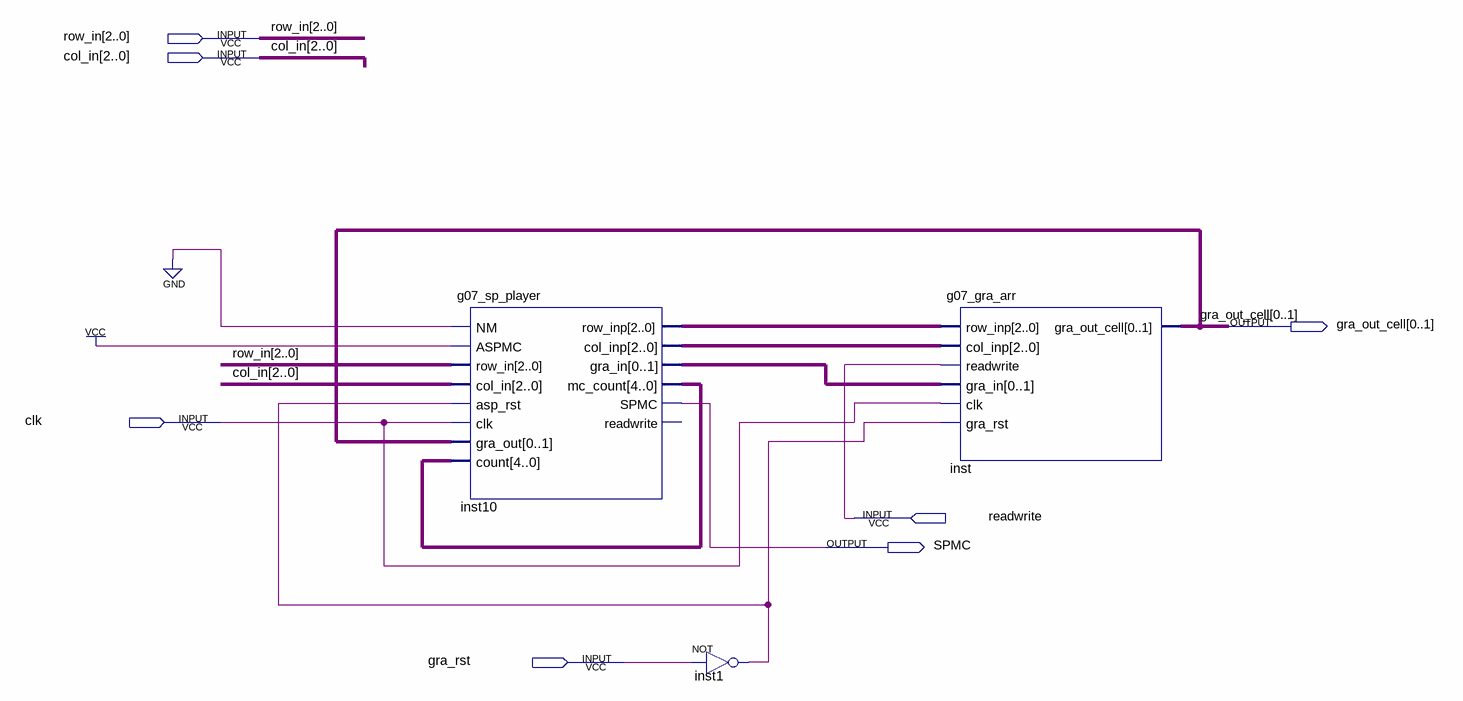
[diagram p0: schematic sheet]
// Quartus schematic g07_sp_next_move.bdf as structural Verilog: 3 symbols, 7 pins
module g07_sp_next_move (
  input  [2:0] row_in,
  input  [2:0] col_in,
  input  clk,
  input  readwrite,
  input  gra_rst,
  output [0:1] gra_out_cell,
  output SPMC
);

  wire inst1_out;
  wire [1:0] inst10_gra_in;
  wire [2:0] inst10_col_inp, inst10_row_inp;
  wire [4:0] inst10_mc_count;

  g07_sp_player inst10 (
    .NM(1'b0), .ASPMC(1'b1), .row_in(row_in), .col_in(col_in), .asp_rst(inst1_out), .clk(clk),
    .gra_out(gra_out_cell), .count(inst10_mc_count), .row_inp(inst10_row_inp), .col_inp(inst10_col_inp),
    .gra_in(inst10_gra_in), .mc_count(inst10_mc_count), .SPMC(SPMC));  // open: readwrite
  not inst1 (inst1_out, gra_rst);
  g07_gra_arr inst (
    .row_inp(inst10_row_inp), .col_inp(inst10_col_inp), .readwrite(readwrite), .gra_in(inst10_gra_in),
    .clk(clk), .gra_rst(inst1_out), .gra_out_cell(gra_out_cell));
endmodule
